# EAGLE design gauges_ser (EAGLE 8.3.2)
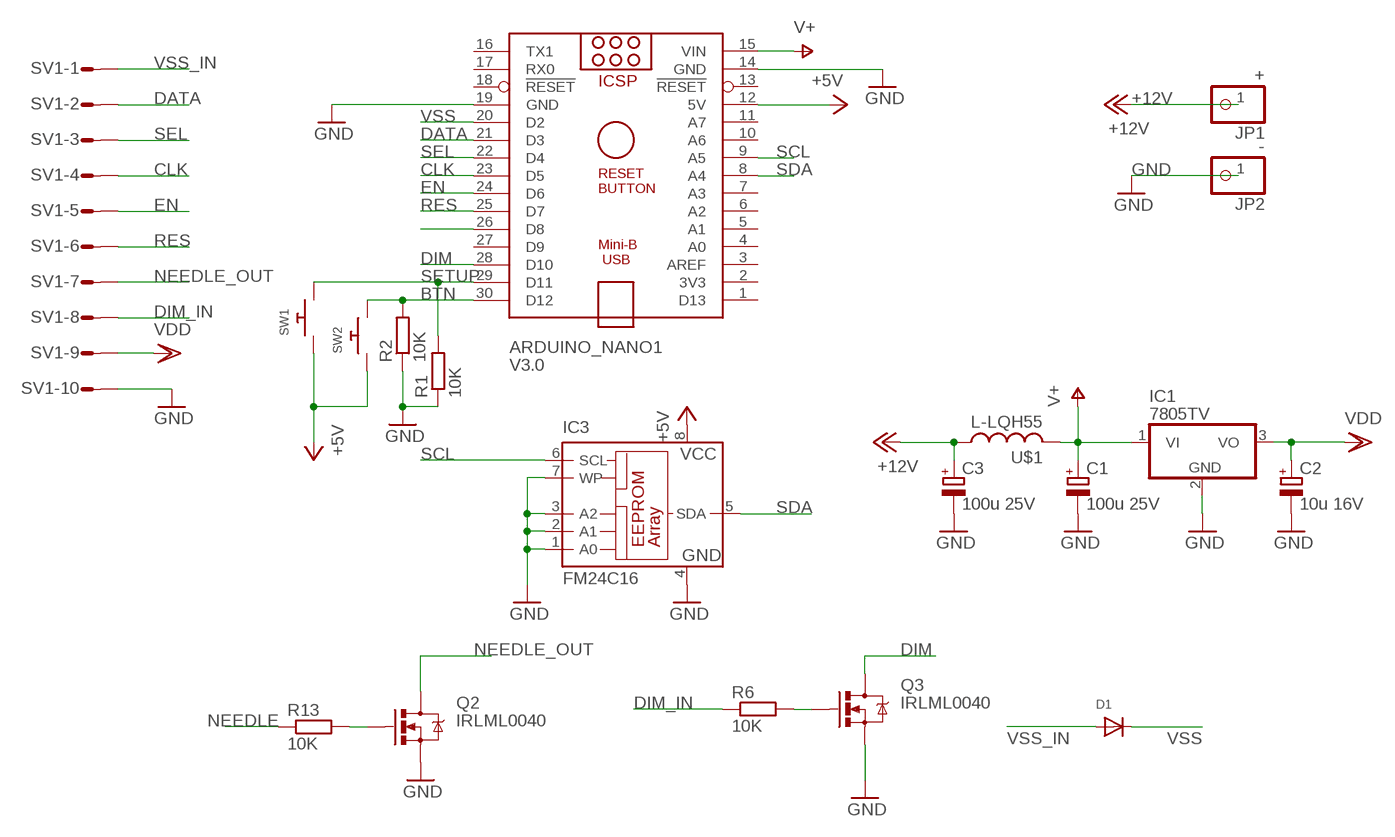
[diagram p0: schematic, sheet 1]

## Parts
ARDUINO_NANO1  V3.0  ARDUINO_NANO  [ARDUINO_NANO]
C1  100u 25V  CPOL-EUSMCD  [SMC_D]
C2  10u 16V  CPOL-EUSMCB  [SMC_B]
C3  100u 25V  CPOL-EUSMCD  [SMC_D]
D1  DIODESOD-123  [SOD-123]
IC1  7805TV  [TO220V]
IC3  FM24C16  24LC64SM  [SO-08M]
JP1  +  PINHD-1X1  [1X01]
JP2  -  PINHD-1X1  [1X01]
Q2  IRLML0040  MOSFET-NCHANNELAO3404A  [SOT23-3]
Q3  IRLML0040  MOSFET-NCHANNELAO3404A  [SOT23-3]
R1  10K  R-EU_R0805  [R0805]
R2  10K  R-EU_R0805  [R0805]
R6  10K  R-EU_R0805  [R0805]
R13  10K  R-EU_R0805  [R0805]
SV1  L10P  [L10P]
SW1  SWITCH_PUSHBUTTONEVQ-PE  [TACT_PANA-EVQ]
SW2  SWITCH_PUSHBUTTONEVQ-PE  [TACT_PANA-EVQ]
U$1  L-LQH55  [LQH55]

## Nets
+5V: ARDUINO_NANO1.12(5V) IC3.8(VCC) SW1.P$1 SW2.P$1
+12V: C3.+ JP1.1 U$1.1
BTN: ARDUINO_NANO1.30(D12) R2.2 SW2.P$2
CLK: ARDUINO_NANO1.23(D5) SV1.4
DATA: ARDUINO_NANO1.21(D3) SV1.2
DIM: ARDUINO_NANO1.28(D10) Q3.3(D)
DIM_IN: R6.1 SV1.8
EN: ARDUINO_NANO1.24(D6) SV1.5
GND: ARDUINO_NANO1.14(GND) ARDUINO_NANO1.19(GND) C1.- C2.- C3.- IC1.2(GND) IC3.1(A0) IC3.2(A1) IC3.3(A2) IC3.4(GND) IC3.7(WP) JP2.1 Q2.2(S) Q3.2(S) R1.1 R2.1 SV1.10
N$6: Q2.1(G) R13.2
N$7: Q3.1(G) R6.2
NEEDLE: ARDUINO_NANO1.26(D8) R13.1
NEEDLE_OUT: Q2.3(D) SV1.7
RES: ARDUINO_NANO1.25(D7) SV1.6
SCL: ARDUINO_NANO1.9(A5) IC3.6(SCL)
SDA: ARDUINO_NANO1.8(A4) IC3.5(SDA)
SEL: ARDUINO_NANO1.22(D4) SV1.3
SETUP: ARDUINO_NANO1.29(D11) R1.2 SW1.P$2
V+: ARDUINO_NANO1.15(VIN) C1.+ IC1.1(VI) U$1.2
VDD: C2.+ IC1.3(VO) SV1.9
VSS: ARDUINO_NANO1.20(D2) D1.C
VSS_IN: D1.A SV1.1
Unconnected: ARDUINO_NANO1.1(D13) ARDUINO_NANO1.2(3V3) ARDUINO_NANO1.3(AREF) ARDUINO_NANO1.4(A0) ARDUINO_NANO1.5(A1) ARDUINO_NANO1.6(A2) ARDUINO_NANO1.7(A3) ARDUINO_NANO1.10(A6) ARDUINO_NANO1.11(A7) ARDUINO_NANO1.13(!RESET) ARDUINO_NANO1.16(TX1) ARDUINO_NANO1.17(RX0) ARDUINO_NANO1.18(!RESET) ARDUINO_NANO1.27(D9)

## Library data of the parts
ARDUINO_NANO1 = ArduinoNanoV30:ARDUINO_NANO: Arduino Nano V3.0 Overview: The Arduino Nano is a small, complete, and breadboard-friendly board based on the ATmega328 (Arduino Nano 3.x) or ATmega168 (Arduino Nano 2.x). It has more or less the same functionality of the Arduino Duemilanove, but in a different package. It lacks only a DC power jack, and works with a Mini-B USB cable instead of a standard one. The Nano was designed and is being produced by Gravitech. Specifications: Microcontroller Atmel ATmega168 or ATmega328 Operating Voltage (logic level) 5 V Input Voltage (recommended) 7-12 V Input Voltage (limits) 6-20 V Digital I/O Pins 14 (of which 6 provide PWM output) Analog Input Pins 8 DC Current per I/O Pin 40 mA Flash Memory 16 KB (ATmega168) or 32 KB (ATmega328) of which 2 KB used by bootloader SRAM 1 KB (ATmega168) or 2 KB (ATmega328) EEPROM 512 bytes (ATmega168) or 1 KB (ATmega328) Clock Speed 16 MHz Dimensions 0.73" x 1.70" Length 45 mm Width 18 mm Weigth 5 g Power: The Arduino Nano can be powered via the Mini-B USB connection, 6-20V unregulated external power supply (pin 30), or 5V regulated external power supply (pin 27). The power source is automatically selected to the highest voltage source. Memory: The ATmega168 has 16 KB of flash memory for storing code (of which 2 KB is used for the bootloader); the ATmega328 has 32 KB, (also with 2 KB used for the bootloader). The ATmega168 has 1 KB of SRAM and 512 bytes of EEPROM (which can be read and written with the EEPROM library); the ATmega328 has 2 KB of SRAM and 1 KB of EEPROM. Input and Output: Each of the 14 digital pins on the Nano can be used as an input or output, using pinMode(), digitalWrite(), and digitalRead() functions. They operate at 5 volts. Each pin can provide or receive a maximum of 40 mA and has an internal pull-up resistor (disconnected by default) of 20-50 kOhms. In addition, some pins have specialized functions. Visit Arduino - ArduinoBoardNano <https://www.arduino.cc/en/Main/ArduinoBoardNano>
C1-C3 = rcl:CPOL-EU: POLARIZED CAPACITOR, European symbol
D1 = adafruit:DIODE: Diode SMADIODE - SMA Surface Mount Package 20V 1A Schottky Diode Digikey: 641-1014-6-ND DO-1N4148 - Through Hole Small Current Diode SOD-123 20V 1 A (.5mV Vf) Schottky Diode - Digikey: MBRX120TPMSCT-ND SOD-323 10V 570mA (.38mV Vf, 3ns) Schottky Diode - Digikey: ZLLS410CT-ND SOD-523 30V 30mA Schottky Diode (RB751S-40TE61) - Digikey: RB751S-40TE61CT-ND SOT23-R/W - SOT23 Package (R = Solder Paste/Reflow Ovens, W = Hand-Soldering) BAT54Film 40V 300mA - Digikey: 497-7162-1-ND
IC1 = linear:78*: Positive VOLTAGE REGULATOR Source: http://cache.national.com/ds/LM/LM78L05.pdf http://www.fairchildsemi.com/ds/LM/LM7805.pdf
IC3 = microchip:24*: Serial EEPROM I2C; MF: MICROCHIP; MPN: 24LC64T-I/SN; OC_FARNELL: 9758070; OC_NEWARK: 12C2021
JP1 JP2 = pinhead:PINHD-1X1: PIN HEADER
Q2 Q3 = SparkFun-DiscreteSemi:MOSFET-NCHANNEL: Common NMOSFET Parts MFG P/N Store ID Prod ID FDD8780 TRANS-09984 SI7820DN TRANS-11055 FDS6630A IC-08089 2N7002PW TRANS-11151 FQP30N06L COM-10213 TRANS-10060 BSS123LT1G TRANS-08345 BSS138 TRANS-00830 BS170 2N7000; PROD_ID: TRAN-12988
R1 R2 R6 R13 = rcl:R-EU_: RESISTOR, European symbol
SV1 = con-amp-mt:L10P: AMP MT CONNECTOR; OC_FARNELL: unknown; OC_NEWARK: unknown
SW1 SW2 = adafruit:SWITCH_PUSHBUTTON: Buttons SOFTTOUCHSMD_SJ - Soft touch temporary push button (Super Junk Akihabara) Compatible with SKPMANE010 [Mouser: 688-SKPMAN] C&K_KSS = Digikey: KSS221GLFS
U$1 = adafruit:L

## Board
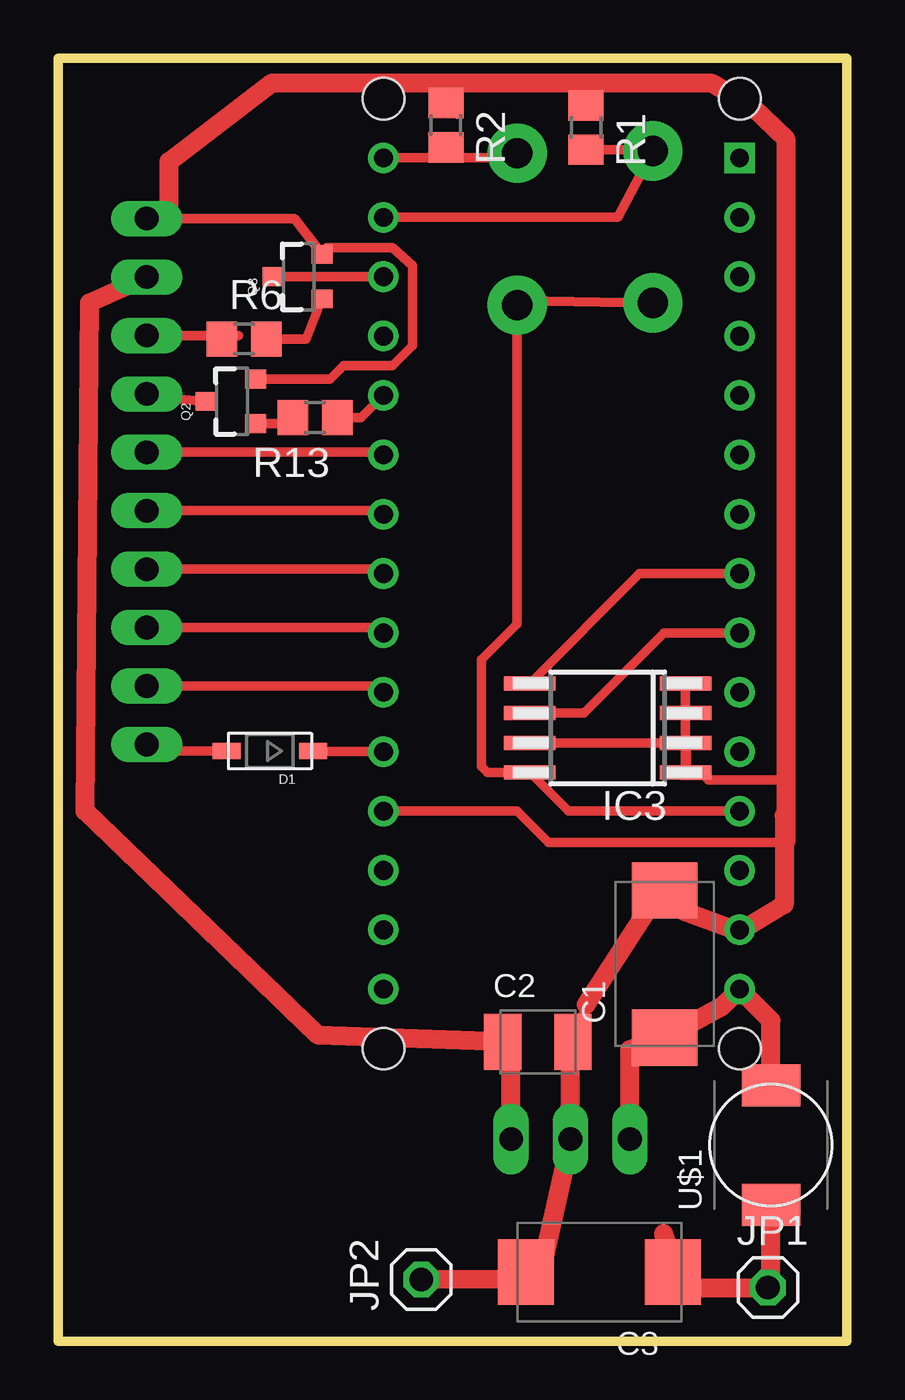
[diagram p1: board, top side]
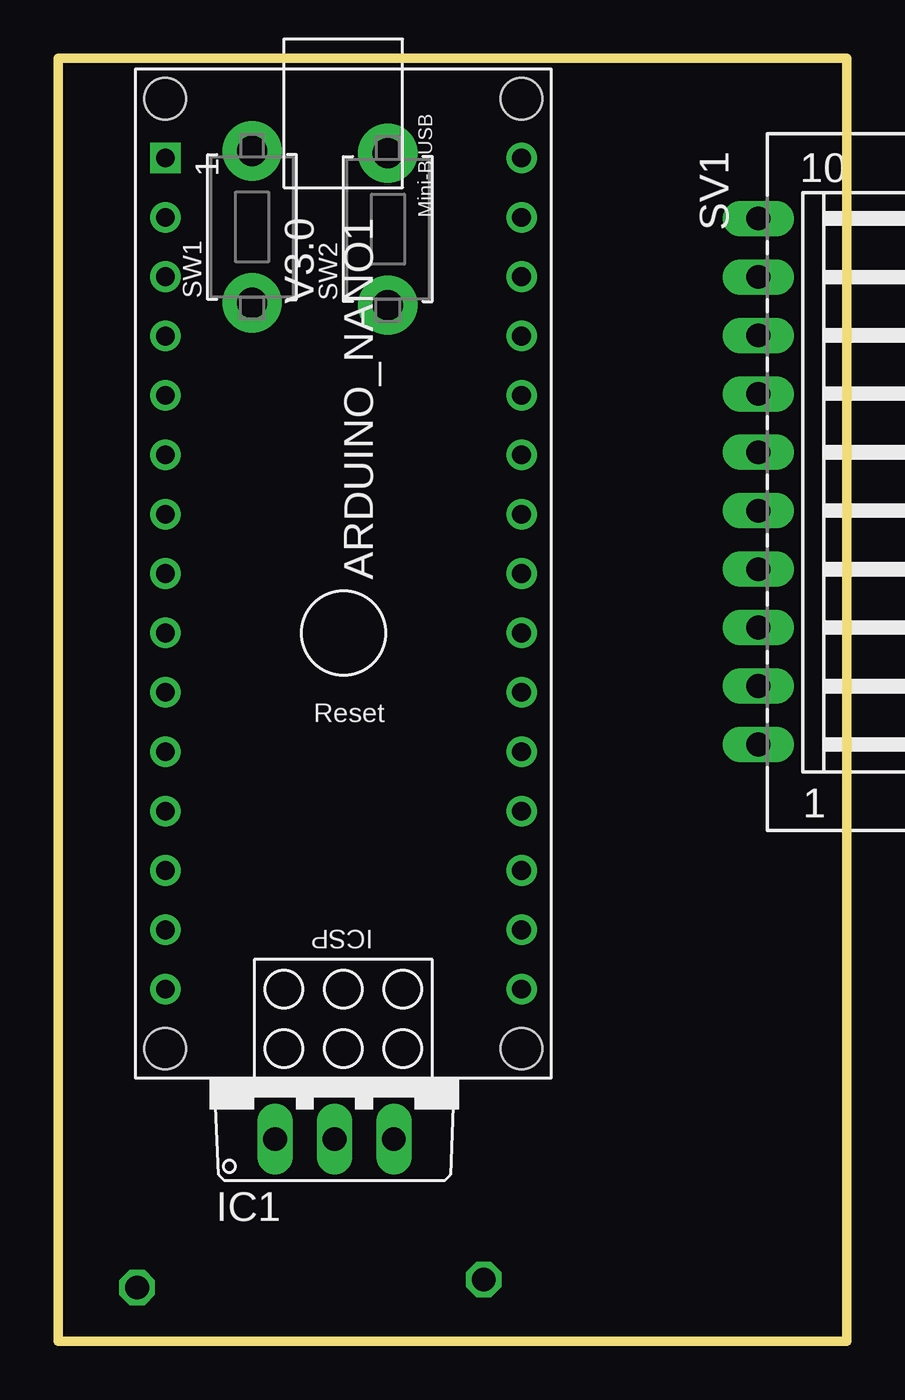
[diagram p2: board, bottom side, seen from below]

Size 33.72 x 54.86 mm. Coordinates in mm from the lower left corner, seen from the top.
Outline: 33.72,54.86 0,54.86 0,0 33.72,0 33.72,54.86
Copper layers (1*16): Top 0.035mm / dielectric 1.5mm / Bottom 0.035mm
Design rules "default": minimum track width 10mil, minimum drill 24mil, track to track 8mil, track to pad 8mil, pad to pad 8mil, via to via 8mil, smd to smd 8mil, copper to edge 40mil, drill to drill 8mil, minimum pad ring 10mil, minimum via ring 8mil, stop-mask expansion 4mil, vias tented up to drill 0mil, thermal gap 10mil

### Footprints (pad centres in the part's own frame; a part is rotated, then mirrored left to right if it is on the bottom)
ARDUINO_NANO = drill 0.8 square: 1 -20.32,-7.62 | drill 0.8: 2 -17.78,-7.62; 3 -15.24,-7.62; 4 -12.7,-7.62; 5 -10.16,-7.62; 6 -7.62,-7.62; 7 -5.08,-7.62; 8 -2.54,-7.62; 9 0,-7.62; 10 2.54,-7.62; 11 5.08,-7.62; 12 7.62,-7.62; 13 10.16,-7.62; 14 12.7,-7.62; 15 15.24,-7.62; 16 15.24,7.62; 17 12.7,7.62; 18 10.16,7.62; 19 7.62,7.62; 20 5.08,7.62; 21 2.54,7.62; 22 0,7.62; 23 -2.54,7.62; 24 -5.08,7.62; 25 -7.62,7.62; 26 -10.16,7.62; 27 -12.7,7.62; 28 -15.24,7.62; 29 -17.78,7.62; 30 -20.32,7.62 | hole 1.778: -22.86,-7.62; -22.86,7.62; 17.78,7.62; 17.78,-7.62
SMC_D = smd 2.4 x 2.8: + -3.15,0; - 3.15,0
SMC_B = smd 1.6 x 2.4: + -1.5,0; - 1.5,0
SOD-123 = smd 1.2 x 0.7: A 1.85,0; C -1.85,0
TO220V = drill 1.016 long: 1 -2.54,-2.54; 2 0,-2.54; 3 2.54,-2.54
SO-08M = smd 0.6 x 2.2: 1 -1.905,-3.33; 2 -0.635,-3.33; 3 0.635,-3.33; 4 1.905,-3.33; 5 1.905,3.33; 6 0.635,3.33; 7 -0.635,3.33; 8 -1.905,3.33
1X01 = drill 1.016 octagon: 1 0,0
SOT23-3 = smd 0.8 x 0.9: 1 -0.95,-1; 2 0.95,-1; 3 0,1.1
R0805 = smd 1.3 x 1.5: 1 -0.95,0; 2 0.95,0
L10P = drill 1.016 long: 1 11.25,-6.25; 2 8.75,-6.25; 3 6.25,-6.25; 4 3.75,-6.25; 5 1.25,-6.25; 6 -1.25,-6.25; 7 -3.75,-6.25; 8 -6.25,-6.25; 9 -8.75,-6.25; 10 -11.25,-6.25
TACT_PANA-EVQ = drill 1.3 pad 2.54: P$1 -3.25,0; P$2 3.25,0
LQH55 = smd 1.8 x 2.5: 1 -2.55,0; 2 2.55,0

### Placement (x,y rotation side)
ARDUINO_NANO1  21.53,30.29 270 bottom
C1  25.94,16.13 90 top
C2  20.51,12.8 0 top
C3  23.15,2.95 180 top
D1  9.05,25.24 180 top
IC1  21.91,11.18 0 bottom
IC3  23.49,26.23 90 top
JP1  30.35,2.29 0 top
JP2  15.53,2.64 90 top
Q2  7.43,40.2 90 top
Q3  10.29,45.53 90 top
R1  22.57,51.91 270 top
R2  16.57,52.01 270 top
R6  7.94,42.86 0 top
R13  10.99,39.5 180 top
SV1  -2.48,36.77 270 bottom
SW1  25.43,47.66 90 bottom
SW2  19.62,47.56 90 bottom
U$1  30.48,8.38 90 top

### Tracks (layer width: path | path; a pad name or v marks a point on that pad's centre or on a via)
+5V
  Top 0.406: ARDUINO_NANO1.12 21.82,22.67 IC3.8 18.35,24.32 18.1,24.57 18.1,29.15 19.62,30.67 SW2.P$1 19.81,44.5 SW1.P$1
+12V
  Top 0.406: JP1.1 30.19,2.29
  Top 0.813: C3.+ 25.88,4.6 26.67,2.29 30.19,2.29 30.48,2.29 U$1.1
BTN
  Top 0.406: 16.57,50.61 ARDUINO_NANO1.30 | 16.57,50.61 19.42,50.61 SW2.P$2 | R2.2 16.57,50.61
CLK
  Top 0.406: SV1.4 13.72,33.02 ARDUINO_NANO1.23
DATA
  Top 0.406: SV1.2 13.64,28.02 ARDUINO_NANO1.21
DIM
  Top 0.406: Q3.3 ARDUINO_NANO1.28
DIM_IN
  Top 0.406: SV1.8 7.71,43.02 R6.1
EN
  Top 0.406: SV1.5 13.76,35.52 ARDUINO_NANO1.24
GND
  Top 0.406: SV1.10 4.73,48.02 5.13,48.02 10.1,48.01 Q3.2 11.48,46.77 14.29,46.77 15.14,46.01 15.14,42.58 14.29,41.72 12.19,41.72 11.62,41.15 Q2.2 | IC3.4 IC3.3 IC3.2 | IC3.2 IC3.1 | IC3.2 IC3.7 26.8,25.59 26.86,25.53 26.86,24.38 26.67,24.19 27.62,24.19 27.81,24 31.12,24 | 22.58,14.39 C2.- 21.91,12.41 | 29.08,17.53 ARDUINO_NANO1.14 29.15,17.53 | 13.76,22.81 ARDUINO_NANO1.19 19.62,22.67 20.95,21.34 31.12,21.34 31.05,22.48 | C1.- 26.48,18.99 26.77,18.38 26.29,18.76 25.72,18.76 25.24,18.48 | 20.67,3.12 C3.- | R2.1 16.57,53.44 | R1.1 22.76,53.05 | R1.1 22.86,53.15 | R2.1 17.04,52.49 | 16.57,53.82 R2.1 | 22.57,53.82 R1.1
  Top 0.813: 22.58,14.39 25.24,18.48 | 21.91,12.41 IC1.2 20.67,3.12 | 4.73,48.02 4.73,50.45 9.14,53.82 16.57,53.82 22.57,53.82 22.67,53.82 27.91,53.82 29.72,52.77 31.12,51.44 31.12,24 31.12,21.34 | 31.05,22.48 31.05,18.67 29.15,17.53 | 29.08,17.53 26.77,18.38 | JP2.1 20.41,2.67 C3.-
N$6
  Top 0.406: Q2.1 10.16,39.25 R13.2
N$7
  Top 0.406: Q3.1 10.6,42.86 R6.2
NEEDLE
  Top 0.406: R13.1 12.95,39.5 ARDUINO_NANO1.26
NEEDLE_OUT
  Top 0.406: SV1.7 4.67,40.33 Q2.3
RES
  Top 0.406: SV1.6 13.8,38.02 ARDUINO_NANO1.25
SCL
  Top 0.406: ARDUINO_NANO1.9 25.91,30.29 22.48,26.86 IC3.6
SDA
  Top 0.406: ARDUINO_NANO1.8 24.86,32.83 IC3.5
SEL
  Top 0.406: SV1.3 13.68,30.52 ARDUINO_NANO1.22
SETUP
  Top 0.406: ARDUINO_NANO1.29 23.93,48.07 SW1.P$2 25.43,50.96 R1.2
V+
  Top 0.813: U$1.2 30.48,13.72 ARDUINO_NANO1.15 28.36,14.29 C1.+ 24.45,12.47 IC1.1
VDD
  Top 0.406: 19.37,12.87 C2.+
  Top 0.813: IC1.3 19.37,12.87 | C2.+ 11.11,13.08 1.14,22.67 1.33,44.41 SV1.9
VSS
  Top 0.406: ARDUINO_NANO1.20 10.93,25.21 D1.C
VSS_IN
  Top 0.406: D1.A 4.05,25.24 SV1.1